# Altium schematic sheet SN74LVC1G00.SchDoc
size A4
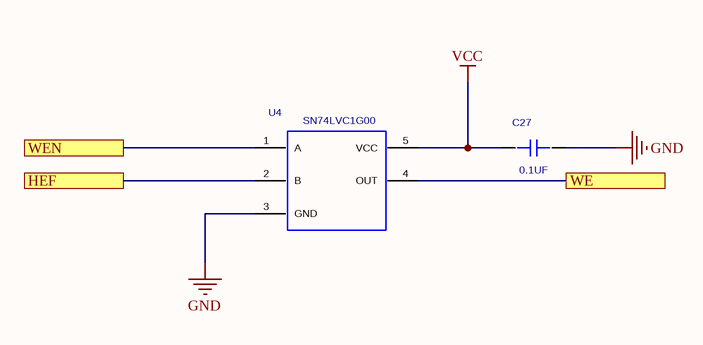
[diagram p0: SN74LVC1G00.SchDoc]

## Parts
C27  value 0.1UF  [SC0402]  (hidden comment: CAP_0.1UF_0402_FIRE)
U4  value SN74LVC1G00  [SOT353_FIRE]  (hidden comment: SN74LVC1G00_FIRE)

## Ports
HEF, WE, WEN

## Nets
GND: C27.1 U4.3(GND)
VCC: C27.2 U4.5(VCC)
HEF: U4.2(B) ; port HEF
WE: U4.4(OUT) ; port WE
WEN: U4.1(A) ; port WEN

## Library data of the parts
C27 = CAP_0.1UF_0402_FIRE: 0402; Manufacture 1 P/N: 0.1uF(0402); PCB DECAL: SC0402
U4 = SN74LVC1G00_FIRE: SN74LVC1G00; Manufacture 1 P/N: SN74LVC1G00; PCB DECAL: SOT353_FIRE